# Altium schematic sheet 主控板.SchDoc: 民用NB-IoT物联网通用膜式燃气表主控板原理图2
size A3; Date: 2022/4/25; DocumentNumber: WX0.008.317; Revision: V1; SheetNumber: 2; SheetTotal: 2
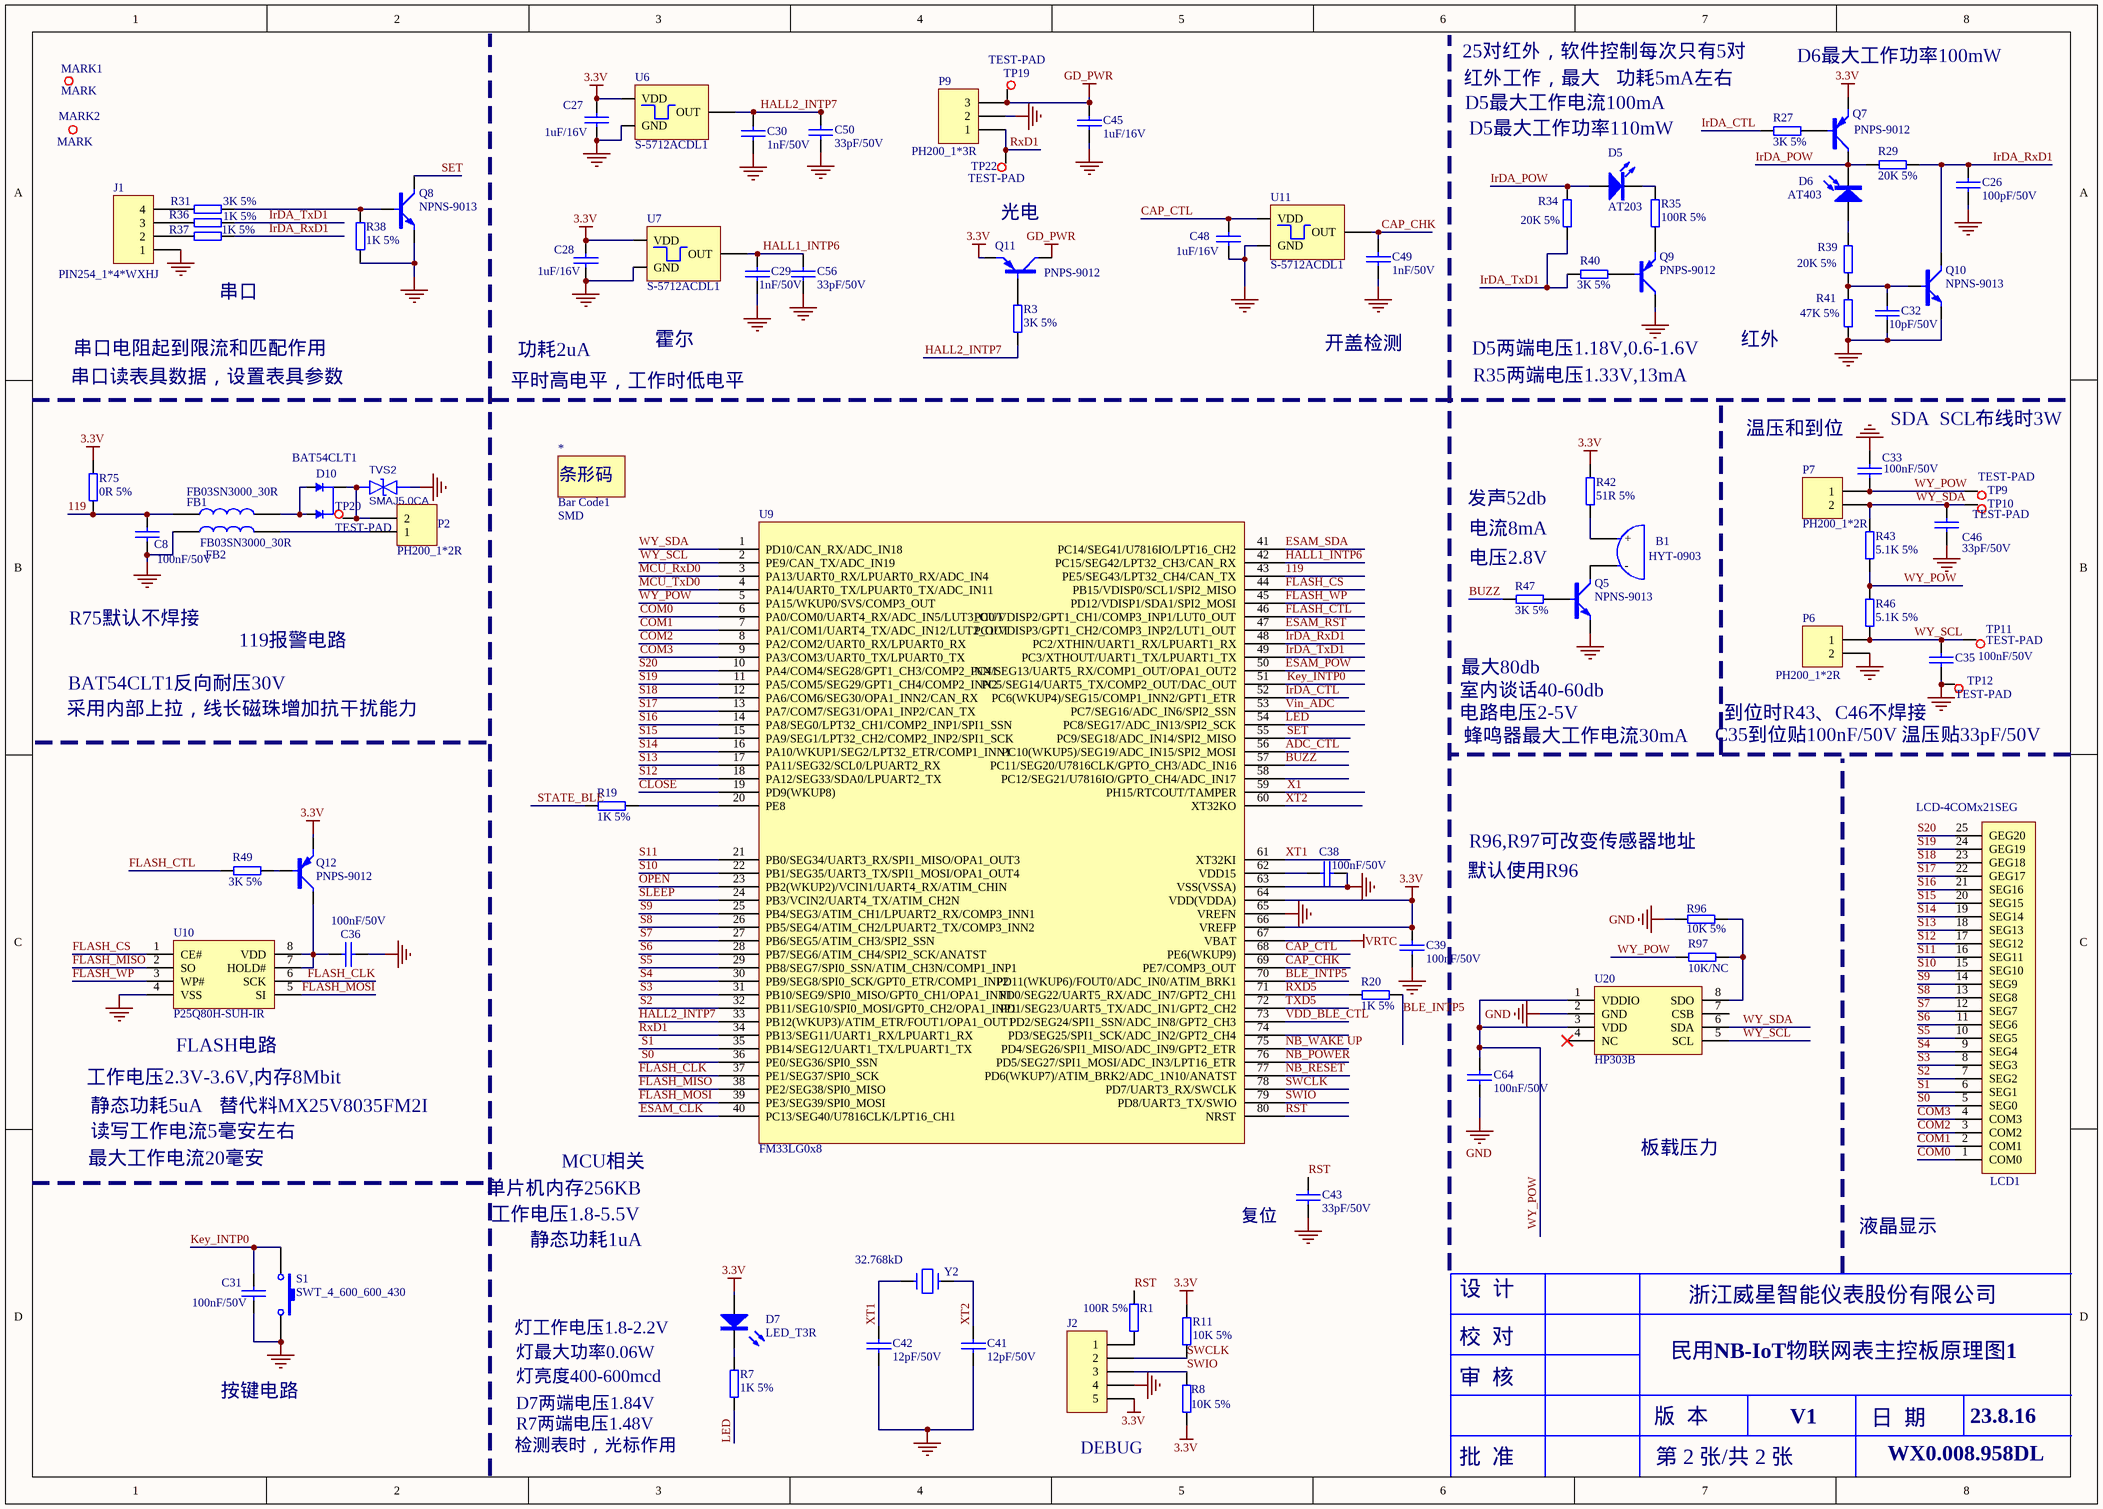
[diagram p0: 主控板.SchDoc]

## Parts
*  Bar Code1  SMD/DIP: SMD  [Bar Code1]
B1  HYT-0903  [HYT-0903]
C8  100nF/50V  [CAP0603]
C26  100pF/50V  [CAP0603]
C27  1uF/16V  [CAP0603]
C28  1uF/16V  [CAP0603]
C29  1nF/50V  [CAP0603]
C30  1nF/50V  [CAP0603]
C31  100nF/50V  [CAP0603]
C32  10pF/50V  [CAP0603]
C33  100nF/50V  [CAP0603]
C35  100nF/50V  [CAP0603]
C36  100nF/50V  [CAP0603]
C38  100nF/50V  [CAP0603]
C39  100nF/50V  [CAP0603]
C41  12pF/50V  [CAP0603]
C42  12pF/50V  [CAP0603]
C43  33pF/50V  [CAP0603]
C45  1uF/16V  [CAP0603]
C46  33pF/50V  [CAP0603]
C48  1uF/16V  [CAP0603]
C49  1nF/50V  [CAP0603]
C50  33pF/50V  [CAP0603]
C56  33pF/50V  [CAP0603]
C64  100nF/50V  [CAP0603]
D5  AT203  [IR_254_532_300]
D6  AT403  [IR_254_532_300]
D7  LED_T3R  [LED2_300]
D10  BAT54CLT1  [SOT-23]
FB1  FB03SN3000_30R  [IND0603]
FB2  FB03SN3000_30R  [IND0603]
J1  PIN254_1*4*WXHJ  [PIN254_1*4*WXHJ]
J2  PIN254_1*5*WXHJ  [PIN254_1*5*WXHJ]  (value not drawn)
LCD1  SMD/DIP: LCD-4COMx21SEG  [LCD_GVH21861A-HPP]  (hidden comment: GVH21861A-HPP)
MARK1  MARK  [MARK]
MARK2  MARK  [MARK]
P2  PH200_1*2R  [PH200_1*2R]
P6  PH200_1*2R  [PH200_1*2R]
P7  PH200_1*2R  [PH200_1*2R]
P9  PH200_1*3R  [PH200_1*3R]
Q5  NPNS-9013  [SOT-23]
Q7  PNPS-9012  [SOT-23]
Q8  NPNS-9013  [SOT-23]
Q9  PNPS-9012  [SOT-23]
Q10  NPNS-9013  [SOT-23]
Q11  PNPS-9012  [SOT-23]
Q12  PNPS-9012  [SOT-23]
R1  100R 5%  [RES0603]
R3  3K 5%  [RES0603]
R7  1K 5%  [RES0603]
R8  10K 5%  [RES0603]
R11  10K 5%  [RES0603]
R19  1K 5%  [RES0603]
R20  1K 5%  [RES0603]
R27  3K 5%  [RES0603]
R29  20K 5%  [RES0603]
R31  3K 5%  [RES0603]
R34  20K 5%  [RES0603]
R35  100R 5%  [RES0603]
R36  1K 5%  [RES0603]
R37  1K 5%  [RES0603]
R38  1K 5%  [RES0603]
R39  20K 5%  [RES0603]
R40  3K 5%  [RES0603]
R41  47K 5%  [RES0603]
R42  51R 5%  [RES0603]
R43  5.1K 5%  [RES0603]
R46  5.1K 5%  [RES0603]
R47  3K 5%  [RES0603]
R49  3K 5%  [RES0603]
R75  0R 5%  [RES0603]
R96  10K 5%  [RES0603]
R97  10K/NC  [RES0603]
S1  SWT_4_600_600_430  [SWT_4_600_600]
TP9  TEST-PAD  [TEST-PAD]
TP10  TEST-PAD  [TEST-PAD]
TP11  TEST-PAD  [TEST-PAD]
TP12  TEST-PAD  [TEST-PAD]
TP19  TEST-PAD  [TEST-PAD]
TP20  TEST-PAD  [TEST-PAD]
TP22  TEST-PAD  [TEST-PAD]
TVS2  SMAJ5.0CA  [SMAJ5.0CA]
U6  S-5712ACDL1  [SOT-23]
U7  S-5712ACDL1  [SOT-23]
U9  FM33LG0x8  [LQFP80]
U10  P25Q80H-SUH-IR  [SOP-8L-200MIL]
U11  S-5712ACDL1  [SOT-23]
U20  HP303B  [LGA_8]
Y2  32.768kD  [SMD-3215_2P]

## Nets
3.3V: C27.1 C28.1 C39.2 D7.1 J2.5 Q7.2(E) Q11.2(E) Q12.2(E) R8.1 R11.1 R42.2 R75.1 U6.1(VDD) U7.1(VDD) U9.64(VDD(VDDA)) U9.66(VREFP)
GD_PWR: C45.1 P9.3 Q11.3(C) TP19.1
GND: C8.2 C26.2 C27.2 C28.2 C29.2 C30.2 C31.2 C32.2 C33.1 C35.2 C36.2 C38.2 C39.1 C41.1 C42.2 C43.2 C45.2 C46.2 C48.2 C49.2 C50.2 C56.2 C64.1 FB2.1 J1.1 J2.4 P6.2 P9.2 Q5.2(E) Q8.2(E) Q9.3(C) Q10.2(E) R38.1 R41.1 R96.1 S1.2 TP12.1 TVS2.1 U6.3(GND) U7.3(GND) U9.63(VSS(VSSA)) U9.65(VREFN) U10.4(VSS) U11.3(GND) U20.2(GND)
VRTC: U9.67(VBAT)
119: C8.1 FB1.1 R75.2 U9.43(PE5/SEG43/LPT32_CH4/CAN_TX)
ADC_CTL: U9.56(PC10(WKUP5)/SEG19/ADC_IN15/SPI2_MOSI)
BLE_INTP5: R20.1 U9.70(PD11(WKUP6)/FOUT0/ADC_IN0/ATIM_BRK1)
BUZZ: R47.1 U9.57(PC11/SEG20/U7816CLK/GPTO_CH3/ADC_IN16)
CAP_CHK: C49.1 U9.69(PE7/COMP3_OUT) U11.2(OUT)
CAP_CTL: C48.1 U9.68(PE6(WKUP9)) U11.1(VDD)
CLOSE: U9.19(PD9(WKUP8))
COM0: LCD1.1(COM0) U9.6(PA0/COM0/UART4_RX/ADC_IN5/LUT3_OUT)
COM1: LCD1.2(COM1) U9.7(PA1/COM1/UART4_TX/ADC_IN12/LUT2_OUT)
COM2: LCD1.3(COM2) U9.8(PA2/COM2/UART0_RX/LPUART0_RX)
COM3: LCD1.4(COM3) U9.9(PA3/COM3/UART0_TX/LPUART0_TX)
ESAM_CLK: U9.40(PC13/SEG40/U7816CLK/LPT16_CH1)
ESAM_POW: U9.50(PC4/SEG13/UART5_RX/COMP1_OUT/OPA1_OUT2)
ESAM_RST: U9.47(PC1/VDISP3/GPT1_CH2/COMP3_INP2/LUT1_OUT)
ESAM_SDA: U9.41(PC14/SEG41/U7816IO/LPT16_CH2)
FLASH_CLK: U9.37(PE1/SEG37/SPI0_SCK) U10.6(SCK)
FLASH_CS: U9.44(PB15/VDISP0/SCL1/SPI2_MISO) U10.1(CE#)
FLASH_CTL: R49.1 U9.46(PC0/VDISP2/GPT1_CH1/COMP3_INP1/LUT0_OUT)
FLASH_MISO: U9.38(PE2/SEG38/SPI0_MISO) U10.2(SO)
FLASH_MOSI: U9.39(PE3/SEG39/SPI0_MOSI) U10.5(SI)
FLASH_WP: U9.45(PD12/VDISP1/SDA1/SPI2_MOSI) U10.3(WP#)
HALL1_INTP6: C29.1 C56.1 U7.2(OUT) U9.42(PC15/SEG42/LPT32_CH3/CAN_RX)
HALL2_INTP7: C30.1 C50.1 R3.1 U6.2(OUT) U9.33(PB12(WKUP3)/ATIM_ETR/FOUT1/OPA1_OUT1)
IrDA_CTL: R27.1 U9.52(PC6(WKUP4)/SEG15/COMP1_INN2/GPT1_ETR)
IrDA_POW: D5.1(A) D6.2(K) Q7.3(C) R29.1 R34.2
IrDA_RxD1: C26.1 Q10.3(C) R29.2 R37.2 U9.48(PC2/XTHIN/UART1_RX/LPUART1_RX)
IrDA_TxD1: R34.1 R36.2 R40.1 U9.49(PC3/XTHOUT/UART1_TX/LPUART1_TX)
Key_INTP0: C31.1 S1.1 U9.51(PC5/SEG14/UART5_TX/COMP2_OUT/DAC_OUT)
LED: R7.1 U9.54(PC8/SEG17/ADC_IN13/SPI2_SCK)
MCU_RxD0: U9.3(PA13/UART0_RX/LPUART0_RX/ADC_IN4)
MCU_TxD0: U9.4(PA14/UART0_TX/LPUART0_TX/ADC_IN11)
NB_POWER: U9.76(PD5/SEG27/SPI1_MOSI/ADC_IN3/LPT16_ETR)
NB_RESET: U9.77(PD6(WKUP7)/ATIM_BRK2/ADC_1N10/ANATST)
NB_WAKE UP: U9.75(PD4/SEG26/SPI1_MISO/ADC_IN9/GPT2_ETR)
OPEN: U9.23(PB2(WKUP2)/VCIN1/UART4_RX/ATIM_CHIN)
RST: C43.1 R1.1 U9.80(NRST)
RxD1: P9.1 TP22.1 U9.34(PB13/SEG11/UART1_RX/LPUART1_RX)
RXD5: R20.2 U9.71(PD0/SEG22/UART5_RX/ADC_IN7/GPT2_CH1)
S0: LCD1.5(SEG0) U9.36(PE0/SEG36/SPI0_SSN)
S1: LCD1.6(SEG1) U9.35(PB14/SEG12/UART1_TX/LPUART1_TX)
S2: LCD1.7(SEG2) U9.32(PB11/SEG10/SPI0_MOSI/GPT0_CH2/OPA1_INP1)
S3: LCD1.8(SEG3) U9.31(PB10/SEG9/SPI0_MISO/GPT0_CH1/OPA1_INN1)
S4: LCD1.9(SEG4) U9.30(PB9/SEG8/SPI0_SCK/GPT0_ETR/COMP1_INP2)
S5: LCD1.10(SEG5) U9.29(PB8/SEG7/SPI0_SSN/ATIM_CH3N/COMP1_INP1)
S6: LCD1.11(SEG6) U9.28(PB7/SEG6/ATIM_CH4/SPI2_SCK/ANATST)
S7: LCD1.12(SEG7) U9.27(PB6/SEG5/ATIM_CH3/SPI2_SSN)
S8: LCD1.13(SEG8) U9.26(PB5/SEG4/ATIM_CH2/LPUART2_TX/COMP3_INN2)
S9: LCD1.14(SEG9) U9.25(PB4/SEG3/ATIM_CH1/LPUART2_RX/COMP3_INN1)
S10: LCD1.15(SEG10) U9.22(PB1/SEG35/UART3_TX/SPI1_MOSI/OPA1_OUT4)
S11: LCD1.16(SEG11) U9.21(PB0/SEG34/UART3_RX/SPI1_MISO/OPA1_OUT3)
S12: LCD1.17(SEG12) U9.18(PA12/SEG33/SDA0/LPUART2_TX)
S13: LCD1.18(SEG13) U9.17(PA11/SEG32/SCL0/LPUART2_RX)
S14: LCD1.19(SEG14) U9.16(PA10/WKUP1/SEG2/LPT32_ETR/COMP1_INN1)
S15: LCD1.20(SEG15) U9.15(PA9/SEG1/LPT32_CH2/COMP2_INP2/SPI1_SCK)
S16: LCD1.21(SEG16) U9.14(PA8/SEG0/LPT32_CH1/COMP2_INP1/SPI1_SSN)
S17: LCD1.22(GEG17) U9.13(PA7/COM7/SEG31/OPA1_INP2/CAN_TX)
S18: LCD1.23(GEG18) U9.12(PA6/COM6/SEG30/OPA1_INN2/CAN_RX)
S19: LCD1.24(GEG19) U9.11(PA5/COM5/SEG29/GPT1_CH4/COMP2_INN2)
S20: LCD1.25(GEG20) U9.10(PA4/COM4/SEG28/GPT1_CH3/COMP2_INN1)
SET: Q8.3(C) U9.55(PC9/SEG18/ADC_IN14/SPI2_MISO)
SLEEP: U9.24(PB3/VCIN2/UART4_TX/ATIM_CH2N)
STATE_BLE: R19.2
SWCLK: J2.2 R11.2 U9.78(PD7/UART3_RX/SWCLK)
SWIO: J2.3 R8.2 U9.79(PD8/UART3_TX/SWIO)
TXD5: U9.72(PD1/SEG23/UART5_TX/ADC_IN1/GPT2_CH2)
VDD_BLE_CTL: U9.73(PD2/SEG24/SPI1_SSN/ADC_IN8/GPT2_CH3)
Vin_ADC: U9.53(PC7/SEG16/ADC_IN6/SPI2_SSN)
WY_POW: C33.2 C64.2 P7.1 R43.1 R46.2 R97.2 TP9.1 U9.5(PA15/WKUP0/SVS/COMP3_OUT) U20.1(VDDIO) U20.3(VDD)
WY_SCL: C35.1 P6.1 R46.1 TP11.1 U9.2(PE9/CAN_TX/ADC_IN19) U20.5(SCL)
WY_SDA: C46.1 P7.2 R43.2 TP10.1 U9.1(PD10/CAN_RX/ADC_IN18) U20.6(SDA)
X1: U9.59(PH15/RTCOUT/TAMPER)
XT1: C42.1 U9.61(XT32KI) Y2.1
XT2: C41.2 U9.60(XT32KO) Y2.2
NetB1_1: B1.1(+) R42.1
NetB1_2: B1.2(-) Q5.3(C)
NetC32_1: C32.1 Q10.1(B) R39.1 R41.2
NetC36_1: C36.1 Q12.3(C) U10.7(HOLD#) U10.8(VDD)
NetC38_1: C38.1 U9.62(VDD15)
NetD5_2: D5.2(K) R35.2
NetD6_1: D6.1(A) R39.2
NetD7_2: D7.2 R7.2
NetD10_1: D10.1(A) D10.2(A) FB1.2
NetD10_3: D10.3(C) P2.2 TP20.1 TVS2.2
NetFB2_2: FB2.2 P2.1
NetJ1_2: J1.2 R37.1
NetJ1_3: J1.3 R36.1
NetJ1_4: J1.4 R31.1
NetJ2_1: J2.1 R1.2
NetQ5_1: Q5.1(B) R47.2
NetQ7_1: Q7.1(B) R27.2
NetQ8_1: Q8.1(B) R31.2 R38.2
NetQ9_1: Q9.1(B) R40.2
NetQ9_2: Q9.2(E) R35.1
NetQ11_1: Q11.1(B) R3.2
NetQ12_1: Q12.1(B) R49.2
NetR19_1: R19.1 U9.20(PE8)
NetR96_2: R96.2 R97.1 U20.8(SDO)

Not connected (* = marked no-connect by the designer): U9 58(PC12/SEG21/U7816IO/GPTO_CH4/ADC_IN17) 74(PD3/SEG25/SPI1_SCK/ADC_IN2/GPT2_CH4); U20 4(NC)* 7(CSB)

## Notes on the sheet
- 25对红外，软件控制每次只有5对
- 红外工作，最大
- D5最大工作电流100mA
- 功耗5mA左右
- D6最大工作功率100mW
- D5最大工作功率110mW
- 光电
- 串口
- 串口读表具数据，设置表具参数
- 串口电阻起到限流和匹配作用
- 功耗2uA
- 霍尔
- 开盖检测
- D5两端电压1.18V,0.6-1.6V
- R35两端电压1.33V,13mA
- 红外
- 平时高电平，工作时低电平
- 温压和到位
- SDA  SCL布线时3W
- 发声52db
- 电流8mA
- 电压2.8V
- R75默认不焊接
- 119报警电路
- 采用内部上拉，线长磁珠增加抗干扰能力
- BAT54CLT1反向耐压30V
- 电路电压2-5V
- 室内谈话40-60db
- 最大80db
- (near P6) 到位时R43、C46不焊接
- 蜂鸣器最大工作电流30mA
- C35到位贴100nF/50V 温压贴33pF/50V
- R96,R97可改变传感器地址
- 默认使用R96
- (near U10) FLASH电路
- 工作电压2.3V-3.6V,内存8Mbit
- 静态功耗5uA
- 替代料MX25V8035FM2I
- 最大工作电流20毫安
- 读写工作电流5毫安左右
- 单片机内存256KB
- MCU相关
- 板载压力
- 工作电压1.8-5.5V
- 静态功耗1uA
- (near C43) 复位
- 液晶显示
- 设  计
- 浙江威星智能仪表股份有限公司
- 按键电路
- 灯工作电压1.8-2.2V
- 灯最大功率0.06W
- 灯亮度400-600mcd
- 审  核
- 校  对
- 民用NB-IoT物联网表主控板原理图1
- 检测表时，光标作用
- D7两端电压1.84V
- R7两端电压1.48V
- (near J2) DEBUG
- 版  本
- V1
- 日  期
- WX0.008.958DL
- 23.8.16
- 批  准
- 第 2 张/共 2 张
- 设   计
- 校   对
- 邓琴琴
- 冯翰
- 审   核
- 标准化
- 版本
- 日期
- 批   准
- 刘晓峰
- 第       张  /  共       张

## Library data of the parts
* = AD_WXHJ_Bar Code_02: 条形码 ,填充，无需焊接器件; ID: 17; Part Number: AD_WXHJ_Bar Code_02; Part Name: 条形码
B1 = 1010602-0007: 直插,直径9mm,高5.5mm,5 V,2 V,30 mA,兴化市华宇电子有限公司,HYT-0903; Part Name: 有源蜂鸣器; ID: 28; SMD/DIP: DIP; Part Number: 1010602-0007
C8 C31 C33 C35 C36 C38 C39 C64 = 101020103-0021: 104pF,50 V,±10%,0603,国巨,CC0603KRX7R9BB104; Part Name: 0603贴片电容; ID: 3; SMD/DIP: SMD; Part Number: 101020103-0021
C26 = 101020103-0010: 101pf,50 V,±5%,0603,国巨,CC0603JRNP09BN101; Part Name: 0603贴片电容; ID: 4; SMD/DIP: SMD; Part Number: 101020103-0010
C27 C28 C45 C48 = 101020103-0003: 105pF,16 V,±10%,0603,国巨,CC0603KRX7R7BB105; Part Name: 0603贴片电容; ID: 14; SMD/DIP: SMD; Part Number: 101020103-0003
C29 C30 C49 = 101020103-0022: 102pF,50 V,±10%,0603,国巨,CC0603KRX7R9BB102; Part Name: 0603贴片电容; ID: 13; SMD/DIP: SMD; Part Number: 101020103-0022
C32 = 101020103-0014: 10pF,50 V,±5%,0603,X7R,国巨,CC0603JRNPO9BN100; Part Name: 0603贴片电容; ID: 7; SMD/DIP: SMD; Part Number: 101020103-0014
C41 C42 = 101020103-0005: 12P,50 V,±5%,0603,国巨,CC0603JRNPO9BN12; Part Name: 0603贴片电容; ID: 11; SMD/DIP: SMD; Part Number: 101020103-0005
C43 C46 C50 C56 = 101020103-0027: 33pF,50 V,±10%,0603,国巨,CC0603KRNPO9BN33; Part Name: 0603贴片电容; ID: 17; SMD/DIP: SMD; Part Number: 101020103-0027
D5 = 101040102-0010: DIP-2,φ3,插件,红光,上海品观电子有限公司/可得,AT203; Part Name: 红外发射管; ID: 1; SMD/DIP: DIP; Part Number: 101040102-0010
D6 = 101040102-0011: DIP-2,φ3,插件,红光,上海品观电子有限公司/可得,AT403-PD-01; Part Name: 光敏二极管; ID: 3; SMD/DIP: DIP; Part Number: 101040102-0011
D7 = 101040102-0001: 圆形插件,3mm 圆形,插件,红光,湖北匡通电子有限公司,3BB4HC; Part Name: 发光二极管; ID: 6; SMD/DIP: DIP; Part Number: 101040102-0001
D10 = 101040101-0038: BAT54CLT1，SOT23-3,SOT23-3,0.2 A,0.8 V,30 V,安森美,BAT54CLT1; Part Name: 贴片肖特基; ID: 31; SMD/DIP: SMD; Part Number: 101040101-0038
FB1 FB2 = 109010101-0003: chilisin(奇力新),0603,30Ω ±25% @100MHz,150 V,125 ℃,PBY160808T-300Y-N,-55 ℃,不含铅,,,圆盘,30Ω ±25% @100MHz; Part Name: 磁珠; ID: 25; SMD/DIP: SMD; Part Number: 109010101-0003
J1 = AD_WXHJ_PinHeader_01: 1*4 ，Φ1.0 ，2.54mm，直脚,无需焊接器件; Part Name: 排针; ID: 16; SMD/DIP: DIP; Part Number: AD_WXHJ_PinHeader_01
J2 = AD_WXHJ_PinHeader_02: 1*5 ，Φ1.0 ，2.54mm，直脚,无需焊接器件; Part Name: 排针; ID: 17; SMD/DIP: DIP; Part Number: AD_WXHJ_PinHeader_02
LCD1 = 1010801-0028: GVH21861A-HPP/GVH20913A－HPP-WG,65*23mm,针脚,段码,21,液晶,全透,60 ℃,-20 ℃,金视界/合肥精显,GVH21861A-HPP/GVH20913A－HPP-WG; Part Name: LCD液晶屏; ID: 8; Part Number: 1010801-0028
MARK1 MARK2 = AD_WXHJ_MARK_01: MARK点; ID: 8; SMD/DIP: SMD; Part Number: AD_WXHJ_MARK_01; Part Name: MARK点
P2 P6 P7 = 1010902-0105: 2.0-2AW,直插弯座，2PIN，脚间距2mm，带防翘起,公头,单排,2.0-2AW;直插弯座，2PIN,脚间距2mm，带防翘起; Part Name: PH座; ID: 11; SMD/DIP: DIP; Part Number: 1010902-0105
P9 = 1010902-0104: 2.0-3AW,3PIN，2mm脚间距,公头,单排,2.0-3AW；3PIN，脚间距2mm直插弯座带防翘起; Part Name: PH座; ID: 12; SMD/DIP: DIP; Part Number: 1010902-0104
Q5 Q8 Q10 = 101040201-0002: 9013,NPN,SOT-23,长电,S9013; Part Name: 贴片三极管; ID: 14; SMD/DIP: SMD; Part Number: 101040201-0002
Q7 Q9 Q11 Q12 = 101040201-0001: 9012,PNP,SOT-23,JCET;长电,S9012; Part Name: 贴片三极管; ID: 16; SMD/DIP: SMD; Part Number: 101040201-0001
R1 R35 = 101010103-0022: 100R,±5%,1/10W,0603,国巨,RC0603JR-07100RL; Part Name: 0603贴片电阻; ID: 5; SMD/DIP: SMD; Part Number: 101010103-0022
R3 R27 R31 R40 R47 R49 = 101010103-0006: 国巨,±5%,0603,,155 ℃,-55 ℃,RC0603JR-073KL,无铅,100 ppm/℃,1/10W,,3K; Part Name: 0603贴片电阻; ID: 22; SMD/DIP: SMD; Part Number: 101010103-0006
R7 R36 R37 = 101010103-0008: 1K,±5%,1/10W,0603,国巨,RC0603JR-071KL; Part Name: 0603贴片电阻; ID: 9; SMD/DIP: SMD; Part Number: 101010103-0008
R8 R11 = 101010103-0003: 国巨,±5%,0603,,155 ℃,-55 ℃,RC0603JR-0710KL,无铅,200 ppm/℃,1/10W,,10K; Part Name: 0603贴片电阻; ID: 7; SMD/DIP: SMD; Part Number: 101010103-0003
R19 R20 R38 = 101010103-0008: 1K,±5%,1/10W,0603,国巨,RC0603JR-071KL; Part Name: 0603贴片电阻; ID: 10; SMD/DIP: SMD; Part Number: 101010103-0008
R29 R34 R39 = 101010103-0004: 国巨,±5%,0603,,155 ℃,-55 ℃,RC0603JR-0720KL,无铅,200 ppm/℃,1/10W,,20K; Part Name: 0603贴片电阻; ID: 15; SMD/DIP: SMD; Part Number: 101010103-0004
R41 = 101010103-0012: 47K,±5%,1/10W,0603,国巨,RC0603JR-0747KL; Part Name: 0603贴片电阻; ID: 25; SMD/DIP: SMD; Part Number: 101010103-0012
R42 = 101010103-0037: 国巨,±5%,0603,,155 ℃,-55 ℃,RC0603JR-0751RL,无铅,100 ppm/℃,1/10W,,51欧; Part Name: 0603贴片电阻; ID: 28; SMD/DIP: SMD; Part Number: 101010103-0037
R43 R46 = 101010103-0015: 国巨,±5%,0603,,155 ℃,55 ℃,RC0603JR-075.1KL,无铅,200 ppm/℃,1/10W,,5.1k; Part Name: 0603贴片电阻; ID: 26; SMD/DIP: SMD; Part Number: 101010103-0015
R75 R96 = 101010103-0001: 国巨,±5%,0603,,155 ℃,-55 ℃,RC0603J2-070RL,无铅,200 ppm/℃,1/10W,,0R; Part Name: 0603贴片电阻; ID: 1; SMD/DIP: SMD; Part Number: 101010103-0001
R97 = 101010103-0002: 国巨,±5%,0603,,155 ℃,-55 ℃,RC0603JR-071ML,无铅,200 ppm/℃,1/10W,,1M
S1 = 1011001-0027: TS-1102,机械轻触,6*6*4.3直插,6*6*4.3直插,乐清市羽欧电子; Part Name: 按键; ID: 30; SMD/DIP: DIP; Part Number: 1011001-0027
TP9-TP12 TP19 TP20 TP22 = AD_WXHJ_TEST-PAD_01: 单面焊盘测试点; Part Name: 测试点; ID: 23; SMD/DIP: SMD; Part Number: AD_WXHJ_TEST-PAD_01
TVS2 = SMAJ5.0CA_C693487: BOM_Manufacturer: FTR; Contributor: LCSC; BOM_Supplier: LCSC; BOM_Supplier Part: C693487; BOM_Manufacturer Part: SMAJ5.0CA; BOM_JLCPCB Part Class: Extended Part; spicePre: D; spiceSymbolName: SMAJ5.0CA_C693487
U6 U7 U11 = 1010504-0002: S-5712ACDL1,SOT23-3,3.5 V,1.6 V,2 uA,精工电子,S-5712ACDL1; Part Name: 霍尔元件; ID: 2; SMD/DIP: SMD; Part Number: 1010504-0002
U10 = 101050101-0165: P25Q80H-SUH-IR,SOP8208mil,普冉半导体（上海）股份有限公司,P25Q80H-SUH-IR; Part Number: 101050101-0218; Part Name: 贴片存储芯片FLASH; ID: 13; SMD/DIP: SMD
Y2 = 1010601-0009: Part Number: 1010601-0020; Part Name: 贴片晶振; ID: 20; SMD/DIP: SMD